# EAGLE design RL78G10_FOOT_A2 (EAGLE 9.6.2)
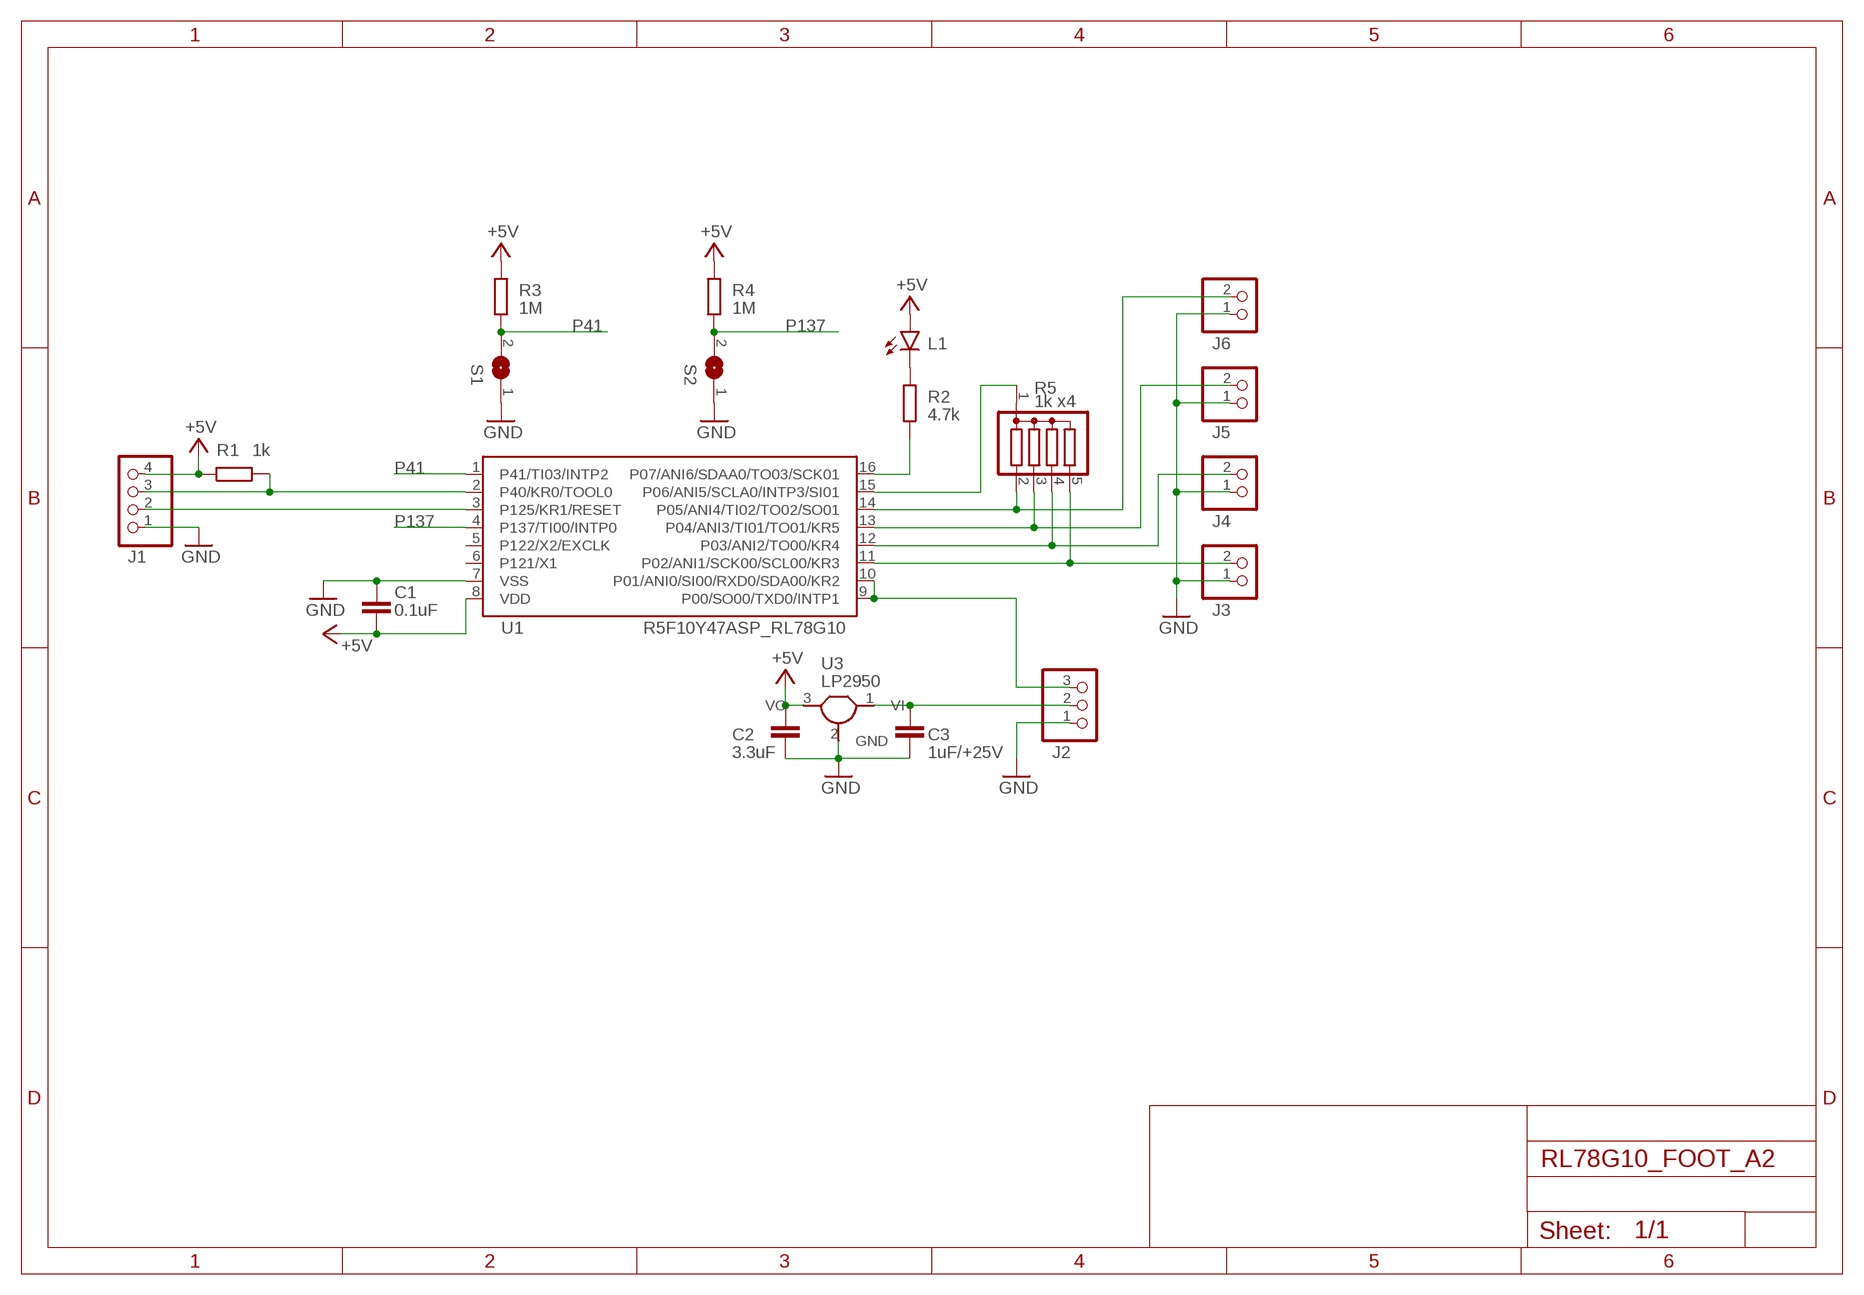
[diagram p0: schematic, sheet 1]

## Parts
C1  0.1uF  C-EUC0603  [C0603]
C2  3.3uF  C-EUC0805  [C0805]
C3  1uF/+25V  C-EUC0805  [C0805]
J1  PINHD_1X4  [PINHD_1X04]
J2  PINHD_1X3  [PINHD_1X03]
J3  PINHD_1X2  [PINHD_1X02]
J4  PINHD_1X2  [PINHD_1X02]
J5  PINHD_1X2  [PINHD_1X02]
J6  PINHD_1X2  [PINHD_1X02]
L1  LEDSML0603  [SML0603]
R1  1k  R-EU_R0603  [R0603]
R2  4.7k  R-EU_R0603  [R0603]
R3  1M  R-EU_R0603  [R0603]
R4  1M  R-EU_R0603  [R0603]
R5  1k x4  G04R  [SIL5]
S1  SJ-OMINI  [SJ-O]
S2  SJ-OMINI  [SJ-O]
U1  R5F10Y47ASP_RL78G10  RL78/G10_16  [SSOP16]
U3  LP2950  [TO92-]

## Nets
+5V: C1.2 C2.1 J1.4 L1.A R1.1 R3.1 R4.1 U1.8(VDD) U3.3(VO)
+V: C3.1 J2.2 U3.1(VI)
ANI1: J3.2 R5.5 U1.11(P02/ANI1/SCK00/SCL00/KR3)
ANI2: J4.2 R5.4 U1.12(P03/ANI2/TO00/KR4)
ANI3: J5.2 R5.3 U1.13(P04/ANI3/TI01/TO01/KR5)
ANI4: J6.2 R5.2 U1.14(P05/ANI4/TI02/TO02/SO01)
GND: C1.1 C2.2 C3.2 J1.1 J2.1 J3.1 J4.1 J5.1 J6.1 S1.1 S2.1 U1.7(VSS) U3.2(GND)
LED: L1.C R2.1
P06: R5.1 U1.15(P06/ANI5/SCLA0/INTP3/SI01)
P41: R3.2 S1.2 U1.1(P41/TI03/INTP2)
P137: R4.2 S2.2 U1.4(P137/TI00/INTP0)
RESET: J1.2 U1.3(P125/KR1/RESET)
SIG: J2.3 U1.9(P00/SO00/TXD0/INTP1) U1.10(P01/ANI0/SI00/RXD0/SDA00/KR2)
TO03: R2.2 U1.16(P07/ANI6/SDAA0/TO03/SCK01)
TOOL0: J1.3 R1.2 U1.2(P40/KR0/TOOL0)
Unconnected: U1.5(P122/X2/EXCLK) U1.6(P121/X1)

## Library data of the parts
C1-C3 = rcl:C-EU: CAPACITOR, European symbol
J1 = MyLib:PINHD_1X4: PIN HEADER
J2 = MyLib:PINHD_1X3: PIN HEADER
J3-J6 = MyLib:PINHD_1X2
L1 = led:LED: LED OSRAM: - CHIPLED LG R971, LG N971, LY N971, LG Q971, LY Q971, LO R971, LY R971 LH N974, LH R974 LS Q976, LO Q976, LY Q976 LO Q996 - Hyper CHIPLED LW Q18S LB Q993, LB Q99A, LB R99A - SideLED LS A670, LO A670, LY A670, LG A670, LP A670 LB A673, LV A673, LT A673, LW A673 LH A674 LY A675 LS A676, LA A676, LO A676, LY A676, LW A676 LS A679, LY A679, LG A679 - Hyper Micro SIDELED® LS Y876, LA Y876, LO Y876, LY Y876 LT Y87S - SmartLED LW L88C, LW L88S LB L89C, LB L89S, LG L890 LS L89K, LO L89K, LY L89K LS L896, LA L896, LO L896, LY L896 - TOPLED LS T670, LO T670, LY T670, LG T670, LP T670 LSG T670, LSP T670, LSY T670, LOP T670, LYG T670 LG T671, LOG T671, LSG T671 LB T673, LV T673, LT T673, LW T673 LH T674 LS T676, LA T676, LO T676, LY T676, LB T676, LH T676, LSB T676, LW T676 LB T67C, LV T67C, LT T67C, LS T67K, LO T67K, LY T67K, LW E67C LS E67B, LA E67B, LO E67B, LY E67B, LB E67C, LV E67C, LT E67C LW T67C LS T679, LY T679, LG T679 LS T770, LO T770, LY T770, LG T770, LP T770 LB T773, LV T773, LT T773, LW T773 LH T774 LS E675, LA E675, LY E675, LS T675 LS T776, LA T776, LO T776, LY T776, LB T776 LHGB T686 LT T68C, LB T68C - Hyper Mini TOPLED® LB M676 - Mini TOPLED Santana® LG M470 LS M47K, LO M47K, LY M47K Source: http://www.osram.convergy.de LUXEON: - LUMILED® LXK2-PW12-R00, LXK2-PW12-S00, LXK2-PW14-U00, LXK2-PW14-V00 LXK2-PM12-R00, LXK2-PM12-S00, LXK2-PM14-U00 LXK2-PE12-Q00, LXK2-PE12-R00, LXK2-PE12-S00, LXK2-PE14-T00, LXK2-PE14-U00 LXK2-PB12-K00, LXK2-PB12-L00, LXK2-PB12-M00, LXK2-PB14-N00, LXK2-PB14-P00, LXK2-PB14-Q00 LXK2-PR12-L00, LXK2-PR12-M00, LXK2-PR14-Q00, LXK2-PR14-R00 LXK2-PD12-Q00, LXK2-PD12-R00, LXK2-PD12-S00 LXK2-PH12-R00, LXK2-PH12-S00 LXK2-PL12-P00, LXK2-PL12-Q00, LXK2-PL12-R00 Source: www.luxeon.com KINGBRIGHT: KA-3528ASYC Source: www.kingbright.com
R1-R4 = rcl:R-EU_: RESISTOR, European symbol
R5 = MyLib:G04R: SIL RESISTOR; OC_FARNELL: unknown; OC_NEWARK: unknown
S1 S2 = MyLib:SJ-O: SMD solder JUMPER
U1 = MyLib:RL78/G10_16
U3 = MyLib:LP2950

## Board
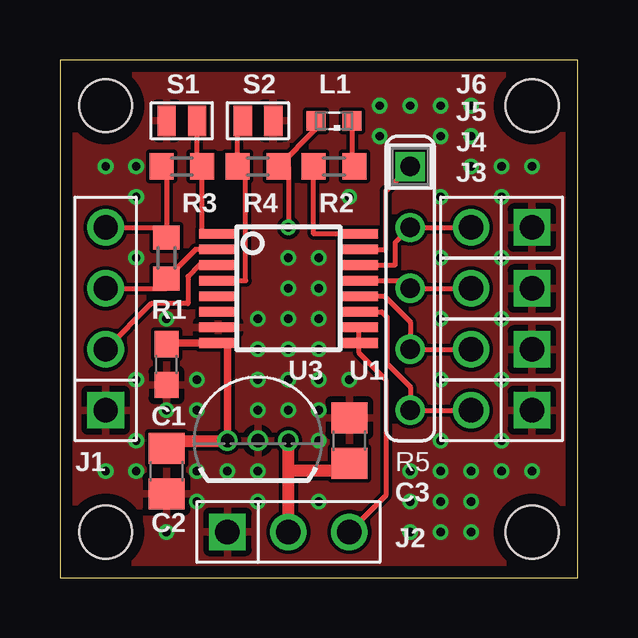
[diagram p1: board, top side]
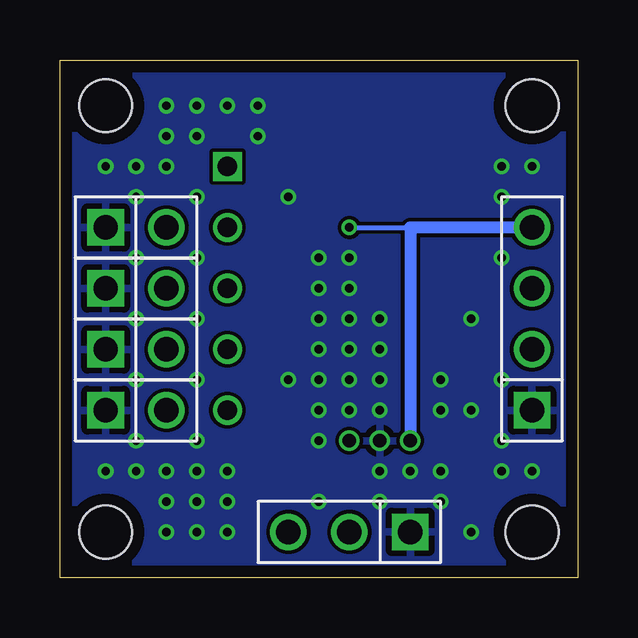
[diagram p2: board, bottom side, seen from below]

Size 21.59 x 21.59 mm. Coordinates in mm from the lower left corner, seen from the top.
Outline: 0,0 21.59,0 21.59,21.59 0,21.59 0,0
Copper layers (1*16): Top 0.035mm / dielectric 1.2mm / Bottom 0.035mm
Design rules "pcbgogo_2layer": minimum track width 6mil, minimum drill 0.3mm, track to track 6mil, track to pad 6mil, pad to pad 6mil, via to via 6mil, smd to smd 6mil, copper to edge 0.5mm, drill to drill 0.3mm, minimum pad ring 0.15mm, minimum via ring 0.15mm, stop-mask expansion 4mil, vias tented up to drill 0.35mm, thermal gap 10mil
Holes 2.2 mm at 1.91,19.68 19.68,19.68 19.68,1.91 1.91,1.91

### Footprints (pad centres in the part's own frame; a part is rotated, then mirrored left to right if it is on the bottom)
C0603 = smd 1.1 x 1: 1 -0.85,0; 2 0.85,0
C0805 = smd 1.3 x 1.5: 1 -0.95,0; 2 0.95,0
PINHD_1X04 = drill 1.016 square: 1 -3.81,0 | drill 1.016: 2 -1.27,0; 3 1.27,0; 4 3.81,0
PINHD_1X03 = drill 1.016 square: 1 -2.54,0 | drill 1.016: 2 0,0; 3 2.54,0
PINHD_1X02 = drill 1.016 square: 1 -1.27,0 | drill 1.016: 2 1.27,0
SML0603 = smd 0.8 x 0.8: A 0.75,0; C -0.75,0
R0603 = smd 1 x 1.1: 1 -0.85,0; 2 0.85,0
SIL5 = drill 0.813 square: 1 -5.08,0 | drill 0.813: 2 -2.54,0; 3 0,0; 4 2.54,0; 5 5.08,0
SJ-O = smd 0.762 x 1.27: 1 -0.635,0; 2 0.635,0
SSOP16 = smd 0.4 x 1.6: 1 -2.275,-2.925; 2 -1.625,-2.925; 3 -0.975,-2.925; 4 -0.325,-2.925; 5 0.325,-2.925; 6 0.975,-2.925; 7 1.625,-2.925; 8 2.275,-2.925; 9 2.275,2.925; 10 1.625,2.925; 11 0.975,2.925; 12 0.325,2.925; 13 -0.325,2.925; 14 -0.975,2.925; 15 -1.625,2.925; 16 -2.275,2.925
TO92- = drill 0.55: 1 1.27,0; 2 0,0; 3 -1.27,0

### Placement (x,y rotation side)
C1  4.45,8.89 90 top
C2  4.45,4.45 270 top
C3  12.06,5.71 90 top
J1  1.91,10.79 90 top
J2  9.53,1.91 0 top
J3  18.41,6.99 180 top
J4  18.41,9.53 180 top
J5  18.41,12.06 180 top
J6  18.41,14.61 180 top
L1  11.43,19.05 180 top
R1  4.45,13.34 270 top
R2  11.43,17.14 180 top
R3  5.08,17.14 0 top
R4  8.26,17.14 180 top
R5  14.61,12.06 270 top
S1  5.08,19.05 0 top
S2  8.26,19.05 180 top
U1  9.53,12.06 270 top
U3  8.26,5.71 0 top

### Tracks (layer width: path | path; a pad name or v marks a point on that pad's centre or on a via)
+5V  (via drill 0.35)
  Top 0.203: J1.4 4.45,14.61 | 4.45,14.61 R1.1 | R3.1 4.45,17.14 4.45,14.61 | v9.53,14.61 9.53,17.14 R4.1 10.68,18.72 L1.A
  Top 0.305: U3.3 6.99,9.79 U1.8 4.45,9.79 C1.2
  Top 0.508: C2.1 4.77,5.71 U3.3
  Bottom 0.203: v9.53,14.61 6.99,14.61
  Bottom 0.508: J1.4 6.99,14.61 U3.3
+V
  Top 0.508: C3.1 11.75,4.45 9.53,4.45 | 9.53,4.45 U3.1 | J2.2 9.53,4.45
ANI1
  Top 0.203: U1.11 13.42,11.09 13.64,10.87 13.64,8.92 14.61,7.96 R5.5 J3.2
ANI2
  Top 0.203: J4.2 R5.4 14.61,10.67 13.53,11.74 U1.12
ANI3
  Top 0.203: U1.13 14.28,12.39 R5.3 J5.2
ANI4
  Top 0.203: U1.14 13.97,13.04 13.97,13.97 R5.2 J6.2
GND  (via drill 0.35)
  other vias: 1.91,4.45 3.17,4.45 3.17,5.71 3.17,15.88 3.17,17.14 1.91,17.14 13.34,19.68 14.61,19.68 15.88,19.68 17.14,19.68 17.14,18.41 17.14,17.14 18.41,17.14 19.68,17.14 19.68,4.45 18.41,4.45 17.14,4.45 17.14,3.17 17.14,1.91 15.88,1.91 15.88,3.17 15.88,4.45 10.79,3.17 8.26,3.17 5.71,3.17 4.45,1.91 6.99,4.45 8.26,4.45 8.26,8.26 9.53,8.26 8.26,9.53 9.53,9.53 10.79,9.53 10.79,8.26 10.79,10.79 10.79,12.06 10.79,13.34 9.53,13.34 9.53,12.06 9.53,10.79 8.26,10.79 15.88,13.34 15.88,10.79 15.88,8.26 18.41,8.26 18.41,10.79 18.41,13.34 18.41,15.88 15.88,15.88 15.88,18.41 13.34,18.41 12.06,15.88 3.17,13.34 3.17,8.26 14.61,1.91 14.61,3.17 14.61,4.45 15.88,5.71 18.41,5.71 4.45,10.79 5.71,8.26 5.71,6.99 12.06,8.26 10.79,6.99 10.79,5.71 5.71,4.45 4.45,6.99 8.26,6.99 9.53,6.99
  pour Top (rank 6): 0,0 0,21.59 21.59,21.59 21.59,0
  pour Bottom (rank 6): 0,0 0,21.59 21.59,21.59 21.59,0
LED
  Top 0.203: L1.C 12.18,17.14 R2.1
P06
  Top 0.203: U1.15 13.59,13.69 13.59,16.13 R5.1
P41
  Top 0.203: U1.1 5.93,14.34 R3.2 5.71,17.14 S1.2
P137
  Top 0.203: U1.4 7.75,12.39 7.75,17.14 R4.2 7.4,19.05 S2.2
RESET
  Top 0.203: J1.2 3.81,11.43 5.33,11.43 5.33,12.56 5.81,13.04 U1.3
SIG
  Top 0.203: U1.10 U1.9 12.45,9.39 13.59,8.26 13.59,3.43 J2.3
TO03
  Top 0.203: U1.16 10.58,14.34 R2.2
TOOL0
  Top 0.203: J1.3 4.45,12.06 R1.2 5.65,13.69 U1.2